# Altium schematic sheet buttons.schdoc
size 179 x 48 mm
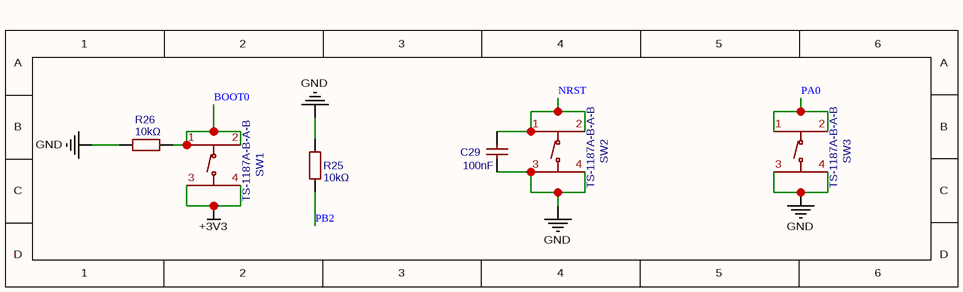
[diagram p0: buttons.schdoc]

## Parts
C29  100nF  [C0402]
R25  10kΩ  [R0402]
R26  10kΩ  [R0402]
SW1  TS-1187A-B-A-B  [SW-SMD_4P-L5.1-W5.1-P3.70-LS6.5-TL-2]
SW2  TS-1187A-B-A-B  [SW-SMD_4P-L5.1-W5.1-P3.70-LS6.5-TL-2]
SW3  TS-1187A-B-A-B  [SW-SMD_4P-L5.1-W5.1-P3.70-LS6.5-TL-2]

## Nets
+3V3: SW1.3(C) SW1.4(D)
GND: C29.1 R25.1 R26.2 SW2.3(C) SW2.4(D) SW3.3(C) SW3.4(D)
BOOT0: R26.1 SW1.1(A) SW1.2(B)
NRST: C29.2 SW2.1(A) SW2.2(B)
PA0: SW3.1(A) SW3.2(B)
PB2: R25.2

## Library data of the parts
C29 = 100nF: Manufacturer Part: CL05B104KO5NNNC; Manufacturer: SAMSUNG(三星); nameAlias: Value; Supplier: LCSC; Supplier Part: C1525; JLCPCB Part Class: Basic Part; spicePre: C; spiceSymbolName: CL05B104KO5NNNC
R25 R26 = 10kΩ: Manufacturer: UNI-ROYAL(厚声); Manufacturer Part: 0402WGF1002TCE; nameAlias: Value; Supplier: LCSC; Supplier Part: C25744; JLCPCB Part Class: Basic Part; spicePre: R; spiceSymbolName: 0402WGF1002TCE
SW1-SW3 = TS-1187A-B-A-B: Manufacturer: XKB Connectivity(中国星坤); Contributor: LCSC; Supplier: LCSC; Supplier Part: C318884; Manufacturer Part: TS-1187A-B-A-B; JLCPCB Part Class: Basic Part; spicePre: S; spiceSymbolName: TS-1187A-B-A-B